# Altium schematic sheet 电流环.SchDoc
size A4
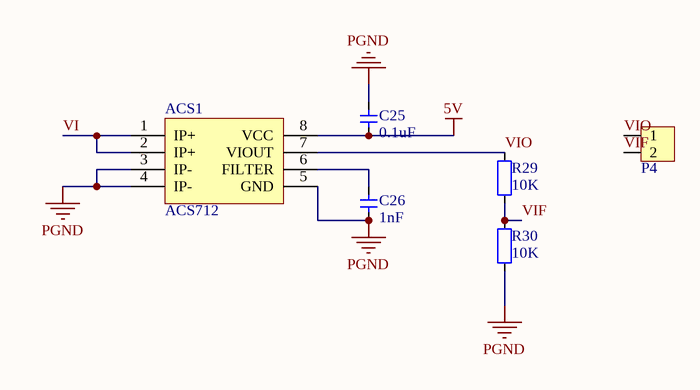
[diagram p0: 电流环.SchDoc]

## Parts
ACS1  ACS712  [SOP8ACS712]
C25  value 0.1uF  [CAP_0603]  (hidden comment: Cap_0603)
C26  value 1nF  [CAP_0603]  (hidden comment: Cap_0603)
P4  HDR1x2_2.54  [HDR1X2_2.54_180]  (value not drawn)
R29  value 10K  [RES_0603]  (hidden comment: Res_0603)
R30  value 10K  [RES_0603]  (hidden comment: Res_0603)

## Nets
5V: ACS1.8(VCC) C25.1
PGND: ACS1.3(IP-) ACS1.4(IP-) ACS1.5(GND) C25.2 C26.1 R30.2
VI: ACS1.1(IP+) ACS1.2(IP+)
VIF: P4.2 R29.2 R30.1
VIO: ACS1.7(VIOUT) P4.1 R29.1
NetACS1_6: ACS1.6(FILTER) C26.2

## Library data of the parts
ACS1 = ACS712: Sensor Current
C25 C26 = Cap_0603: Capacitor
P4 = HDR1x2_2.54: Header
R29 R30 = Res_0603: Resistor